# Altium schematic sheet POWER.SchDoc: HDMI POWER
size A4; SheetNumber: 5; SheetTotal: 5; DOC_NO_SCH_DWG: #012022051404
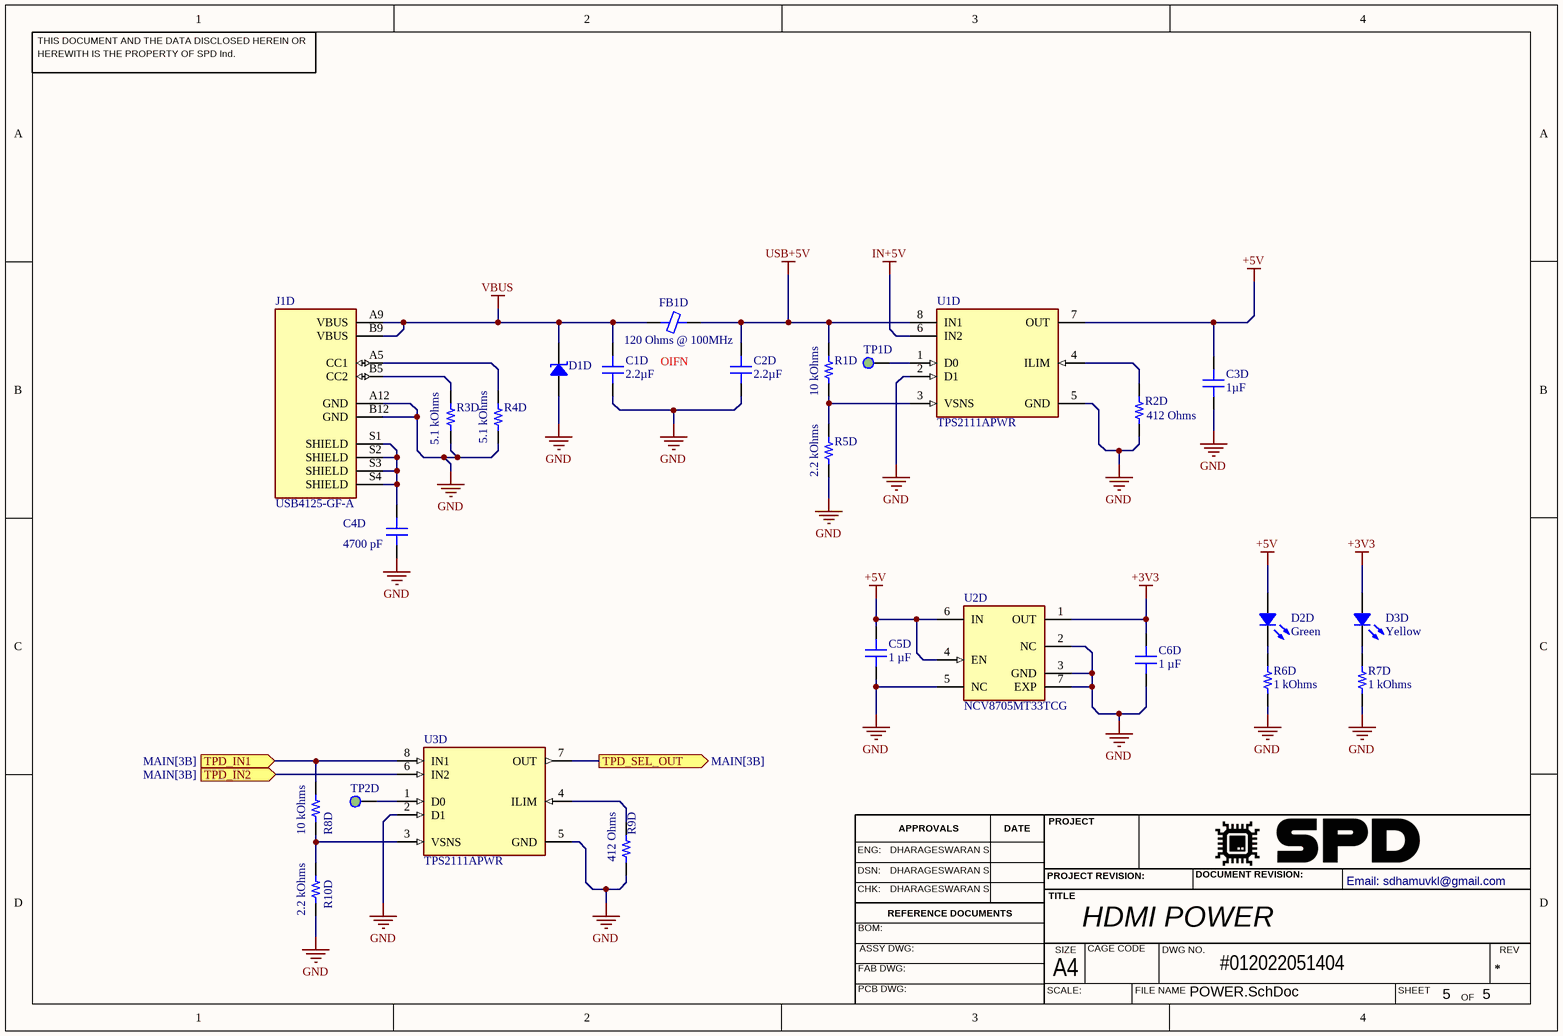
[diagram p0: POWER.SchDoc]

## Parts
C1D  2.2µF  [CAP 0402_1005]
C2D  2.2µF  [CAP 0402_1005]
C3D  1µF  [CAP 0603_1608]
C4D  4700 pF  [CAP 0402_1005]
C5D  1 µF  [CAP 0402_1005]
C6D  1 µF  [CAP 0402_1005]
D1D  VTVS5V0ASMF-M3-08  [SMF DO-219AB]  (value not drawn)
D2D  Green  [LED 0402_1005 GREEN]
D3D  Yellow  [LED 0402_1005 YELLOW]
FB1D  120 Ohms @ 100MHz  [FER 0201_0603]
J1D  USB4125-GF-A  [USB4125-GF-A]
R1D  10 kOhms  [RES 0402_1005]
R2D  412 Ohms  [RES 0402_1005]
R3D  5.1 kOhms  [RES 0402_1005]
R4D  5.1 kOhms  [RES 0402_1005]
R5D  2.2 kOhms  [RES 0402_1005]
R6D  1 kOhms  [RES 0402_1005]
R7D  1 kOhms  [RES 0402_1005]
R8D  10 kOhms  [RES 0402_1005]
R9D  412 Ohms  [RES 0402_1005]
R10D  2.2 kOhms  [RES 0402_1005]
TP1D  ROUND PAD 0.5MM  [ROUND PAD 0.5MM]  (value not drawn)
TP2D  ROUND PAD 0.5MM  [ROUND PAD 0.5MM]  (value not drawn)
U1D  TPS2111APWR  [FP-PW0008A-IPC_B]
U2D  NCV8705MT33TCG  [FP-511BR-MFG]
U3D  TPS2111APWR  [FP-PW0008A-IPC_B]

## Ports
TPD_IN1 (in, see MAIN[3B]), TPD_IN2 (in, see MAIN[3B]), TPD_SEL_OUT (out, see MAIN[3B])

## Nets
+3V3: C6D.2 D3D.1 U2D.1(OUT)
+5V: C3D.2 C5D.2 D2D.1 U1D.7(OUT) U2D.4(EN) U2D.6(IN)
GND: C1D.1 C2D.1 C3D.1 C4D.1 C5D.1 C6D.1 D1D.1 J1D.A12(GND) J1D.B12(GND) R2D.1 R3D.1 R4D.1 R5D.1 R6D.1 R7D.1 R9D.1 R10D.1 U1D.2(D1) U1D.5(GND) U2D.2(NC) U2D.3(GND) U2D.5(NC) U2D.7(EXP) U3D.2(D1) U3D.5(GND)
IN+5V: U1D.6(IN2)
USB+5V: C2D.2 FB1D.2 R1D.2 U1D.8(IN1)
VBUS: C1D.2 D1D.2 FB1D.1 J1D.A9(VBUS) J1D.B9(VBUS)
TPD_IN1: R8D.2 U3D.8(IN1) ; port TPD_IN1
TPD_IN2: U3D.6(IN2) ; port TPD_IN2
TPD_SEL_OUT: U3D.7(OUT) ; port TPD_SEL_OUT
NetC4D_2: C4D.2 J1D.S1(SHIELD) J1D.S2(SHIELD) J1D.S3(SHIELD) J1D.S4(SHIELD)
NetD2D_2: D2D.2 R6D.2
NetD3D_2: D3D.2 R7D.2
NetJ1D_A5: J1D.A5(CC1) R4D.2
NetJ1D_B5: J1D.B5(CC2) R3D.2
NetR1D_1: R1D.1 R5D.2 U1D.3(VSNS)
NetR2D_2: R2D.2 U1D.4(ILIM)
NetR8D_1: R8D.1 R10D.2 U3D.3(VSNS)
NetR9D_2: R9D.2 U3D.4(ILIM)
NetTP1D_1: TP1D.1 U1D.1(D0)
NetTP2D_1: TP2D.1 U3D.1(D0)

## Notes on the sheet
- OIFN
- THIS DOCUMENT AND THE DATA DISCLOSED HEREIN OR
- HEREWITH IS THE PROPERTY OF SPD Ind.
- ENG:
- DHARAGESWARAN S
- APPROVALS
- DATE
- PROJECT
- DSN:
- CHK:
- REFERENCE DOCUMENTS
- PROJECT REVISION:
- TITLE
- DOCUMENT REVISION:
- Email: sdhamuvkl@gmail.com <https://github.com/DhamuVkl>
- BOM:
- FAB DWG:
- PCB DWG:
- ASSY DWG:
- SCALE:
- A4
- SIZE
- CAGE CODE
- FILE NAME
- DWG NO.
- SHEET
- REV
- OF

## Library data of the parts
C1D C2D = 0402ZD225KAT2A: CAP CER 2.2UF 10V X5R 0402; Manufacturer: AVX Corporation; id: 2335; Tolerance: ±10%; Part Number: 0402ZD225KAT2A; Value: 2.2µF; Temperature Coefficient: X5R; Supplier Part Number 1: 478-10072-1-ND; ComponentLink2Description: DigiKey Link; ComponentLink1URL: http://datasheets.avx.com/cx5r.pdf; PartId: 9346; Supplier 1: DigiKey; Series: -; LastUpdated: 2022-02-08T12:26:45.707; Part Status: Active; Capacitance: 2.2µF; Device Package: 0402 (1005 Metric); Thickness (Max): 0.022" (0.56mm); Voltage - Rated: 10V; Minimum Order: 1; Packaging: TapeAndReel; Applications: General Purpose; Package / Case: 0402 (1005 Metric); ComponentLink1Description: Datasheet; Price: 0.09; ComponentLink2URL: http://digikey.com/product-detail/en/avx-corporation/0402ZD225KAT2A/478-10072-1-ND/6564294; Lifecycle Status: Active; Operating Temperature: -55°C ~ 85°C; Size / Dimension: 0.039" L x 0.020" W (1.00mm x 0.50mm); Mounting Type: Surface Mount, MLCC
C3D = 06036D105KAT2A: CAP CER 1UF 6.3V X5R 0603; Manufacturer: AVX Corporation; id: 2190; Tolerance: ±10%; Part Number: 06036D105KAT2A; Value: 1µF; Temperature Coefficient: X5R; Supplier Part Number 1: 478-2581-1-ND; ComponentLink2Description: DigiKey Link; ComponentLink1URL: http://datasheets.avx.com/cx5r.pdf; PartId: 11585; Supplier 1: DigiKey; Series: -; LastUpdated: 2020-09-02T01:03:18.933; Part Status: Active; Capacitance: 1µF; Device Package: 0603 (1608 Metric); Thickness (Max): 0.035" (0.90mm); Voltage - Rated: 6.3V; Minimum Order: 1; Packaging: TapeAndReel; Applications: General Purpose; Package / Case: 0603 (1608 Metric); ComponentLink1Description: Datasheet; Price: 0.03; ComponentLink2URL: http://digikey.com/product-detail/en/avx-corporation/06036D105KAT2A/478-2581-1-ND/717526; Lifecycle Status: Active; Operating Temperature: -55°C ~ 85°C; Size / Dimension: 0.063" L x 0.032" W (1.60mm x 0.81mm); Mounting Type: Surface Mount, MLCC
C4D = C0402C472K4RECAUTO: CAP CER 0402 4.7NF 16V X7R 10%; Manufacturer: KEMET; id: 3032; Part Number: C0402C472K4RECAUTO; Value: 4700 pF; Temperature Coefficient: X7R; Supplier Part Number 1: 399-17875-1-ND; ComponentLink2Description: DigiKey Link; ComponentLink1URL: https://api.kemet.com/component-edge/download/datasheet/C0402C472K4RECAUTO.pdf; PartId: 12122; Tolerance: ±10%; Supplier 1: DigiKey; Series: ESD SMD Auto X7R; LastUpdated: 2023-01-03T20:03:46.940; Part Status: Active; Capacitance: 4700 pF; Device Package: 0402 (1005 Metric); Ratings: AEC-Q200; Thickness (Max): 0.022" (0.55mm); Voltage - Rated: 16V; Minimum Order: 1; Packaging: TapeAndReel; Applications: Automotive, ESD Protection; Package / Case: 0402 (1005 Metric); ComponentLink1Description: Datasheet; Price: 0.01; ComponentLink2URL: https://www.digikey.com/en/products/detail/kemet/C0402C472K4RECAUTO/8640469; Lifecycle Status: Active; Operating Temperature: -55°C ~ 125°C; Size / Dimension: 0.039" L x 0.020" W (1.00mm x 0.50mm); Mounting Type: Surface Mount, MLCC
C5D C6D = GRM155C81C105KE11D: CAP CER 1UF 16V X6S 0402; Manufacturer: Murata Electronics; id: 824; Tolerance: ±10%; Part Number: GRM155C81C105KE11D; Value: 1 µF; Temperature Coefficient: X6S; Supplier Part Number 1: 490-12700-1-ND; ComponentLink2Description: DigiKey Link; ComponentLink1URL: https://search.murata.co.jp/Ceramy/image/img/A01X/G101/ENG/GRM155C81C105KE11-01.pdf; PartId: 3683; Supplier 1: DigiKey; Series: GRM; LastUpdated: 2023-01-03T20:04:13.167; Part Status: Active; Capacitance: 1 µF; Device Package: 0402 (1005 Metric); Thickness (Max): 0.024" (0.60mm); Voltage - Rated: 16V; Minimum Order: 1; Packaging: TapeAndReel; Applications: General Purpose; Package / Case: 0402 (1005 Metric); ComponentLink1Description: Datasheet; Price: 0.01; ComponentLink2URL: https://www.digikey.com/en/products/detail/murata-electronics/GRM155C81C105KE11D/4905091; Lifecycle Status: Active; Operating Temperature: -55°C ~ 105°C; Size / Dimension: 0.039" L x 0.020" W (1.00mm x 0.50mm); Mounting Type: Surface Mount, MLCC
D1D = VTVS5V0ASMF-M3-08: TVS DIODE 5V 8.9V DO219AB; Manufacturer: Vishay Semiconductor Diodes Division; id: 18; Voltage - Breakdown (Min): 6.4V; Power Line Protection: No; Capacitance @ Frequency: 2095pF @ 1MHz; Type: Zener; Current - Peak Pulse (10/1000µs): 42.95A; Power - Peak Pulse: 400W; Unidirectional Channels: 1; Part Number: VTVS5V0ASMF-M3-08; Supplier Part Number 1: VTVS5V0ASMF-M3-08GICT-ND; Voltage - Reverse Standoff (Typ): 5V; Voltage - Clamping (Max) @ Ipp: 8.9V; Supplier Device Package: DO-219AB (SMF); ComponentLink1Description: Datasheet; ComponentLink2URL: http://digikey.com/product-detail/en/vishay-semiconductor-diodes-division/VTVS5V0ASMF-M3-08/VTVS5V0ASMF-M3-08GICT-ND/7056003; ComponentLink1URL: http://www.vishay.com/docs/85891/vtvs3v3asmf.pdf; Supplier 1: DigiKey; Series: TransZorb®; Part Status: Active; ComponentLink2Description: DigiKey Link; Packaging: TapeAndReel; Minimum Order: 1; Applications: General Purpose; Package / Case: DO-219AB; PartId: 5492; Lifecycle Status: Active; LastUpdated: 2023-01-02T21:08:29.887; Operating Temperature: -55°C ~ 175°C (TJ); Mounting Type: Surface Mount; Price: 0.11
D2D = HSMG-C280: LED GREEN DIFFUSED 0402 SMD; Manufacturer: Broadcom Limited; id: 697; Lens Color: White; Wavelength - Peak: 570nm; Lens Style: Rectangle with Flat Top; Viewing Angle: 130°; Lens Size: 1.00mm x 0.50mm; Configuration: Standard; Wavelength - Dominant: 572nm; Voltage - Forward (Vf) (Typ): 2.2V; Current - Test: 20mA; Millicandela Rating: 15mcd; Part Number: HSMG-C280; Supplier Part Number 1: 516-3066-1-ND; Lens Transparency: Diffused; Supplier Device Package: 0402; ComponentLink1Description: Datasheet; Color: Green; ComponentLink2URL: https://www.digikey.com/en/products/detail/broadcom-limited/HSMG-C280/1235358; ComponentLink1URL: https://docs.broadcom.com/docs/AV02-0602EN; Supplier 1: DigiKey; Series: -; Height (Max): 0.40mm; Part Status: Active; ComponentLink2Description: DigiKey Link; Device Package: 0402 (1005 Metric); Packaging: TapeAndReel; Minimum Order: 1; Package / Case: 0402 (1005 Metric); PartId: 697; Lifecycle Status: Active; LastUpdated: 2023-01-02T20:56:26.750; Value: Green; Size / Dimension: 1.00mm L x 0.50mm W; Mounting Type: Surface Mount; Price: 0.08
D3D = XZMYK68W-2: LED YELLOW CLEAR CHIP SMD; Manufacturer: SunLED; id: 167; Lens Color: Colorless; Wavelength - Peak: 590nm; Lens Style: Rectangle with Flat Top; Viewing Angle: 120°; Lens Size: 0.80mm x 0.50mm; Configuration: Standard; Voltage - Forward (Vf) (Typ): 2V; Current - Test: 20mA; Millicandela Rating: 148mcd; Part Number: XZMYK68W-2; Supplier Part Number 1: 1497-1198-1-ND; Lens Transparency: Clear; Supplier Device Package: Chip LED; ComponentLink1Description: Datasheet; Color: Yellow; ComponentLink2URL: https://www.digikey.com/en/products/detail/sunled/XZMYK68W-2/4745801; ComponentLink1URL: https://www.sunledusa.com/products/spec/XZMYK68W-2.pdf; Supplier 1: DigiKey; Series: -; Height (Max): 0.60mm; Part Status: Active; ComponentLink2Description: DigiKey Link; Device Package: 0402 (1005 Metric); Packaging: TapeAndReel; Minimum Order: 1; Package / Case: 0402 (1005 Metric); PartId: 167; Wavelength - Dominant: 590nm; Lifecycle Status: Active; LastUpdated: 2023-01-02T20:57:30.307; Value: Yellow; Size / Dimension: 1.00mm L x 0.50mm W; Mounting Type: Surface Mount; Price: 0.05
FB1D = BKP0603HM121-T: FERRITE BEAD 120 OHM 0201 1LN; Manufacturer: Taiyo Yuden; id: 127; DC Resistance (DCR) (Max): 180mOhm; Number Of Lines: 1; Filter Type: Power Line; Current Rating (Max): 800mA; Part Number: BKP0603HM121-T; Supplier Part Number 1: 587-3283-1-ND; ComponentLink1Description: Datasheet; ComponentLink2URL: http://digikey.com/product-detail/en/taiyo-yuden/BKP0603HM121-T/587-3283-1-ND/4157927; ComponentLink1URL: https://ds.yuden.co.jp/TYCOMPAS/ut/detail?pn=BKP0603HM121-T  &u=M; Supplier 1: DigiKey; Series: BK; Height (Max): 0.013" (0.33mm); Part Status: Active; ComponentLink2Description: DigiKey Link; Device Package: 0201 (0603 Metric); Impedance @ Frequency: 120 Ohms @ 100MHz; Packaging: TapeAndReel; Minimum Order: 1; Package / Case: 0201 (0603 Metric); PartId: 127; Lifecycle Status: Active; LastUpdated: 2023-01-02T20:50:51.660; Operating Temperature: -55°C ~ 85°C; Value: 120 Ohms @ 100MHz; Size / Dimension: 0.024" L x 0.012" W (0.60mm x 0.30mm); Mounting Type: Surface Mount; Price: 0.03
J1D = USB4125-GF-A: CONN RCPT TYPE C 6P SMD RA; Manufacturer: GCT; MP: USB4125-GF-A_REVA2; id: 21; Mating Cycles: 20000; Current Rating (Amps): 3A; Connector Type: USB-C (USB TYPE-C); Number Of Contacts: 24 (6+18 Dummy); Voltage - Rated: 20VDC; Shielding: Shielded; Number Of Ports: 1; Gender: Receptacle; Package: None; Availability: Unavailable; Value: *; Price: 0.67; Part Number: USB4125-GF-A; Supplier Part Number 1: 2073-USB4125-GF-ACT-ND; Specifications: -; Termination: Solder; ComponentLink1Description: Datasheets; ComponentLink6URL: https://gct.co/files/info/gct_certificate_of_compliance.pdf; ComponentLink2URL: https://mm.digikey.com/Volume0/opasdata/d220001/medias/docus/5561/USB4125 - Product Spec.pdf; Features: Power Only, No Data; Solder Retention Tab; ComponentLink1URL: https://mm.digikey.com/Volume0/opasdata/d220001/medias/docus/5407/gct-usb-type-c-product-selection-guide-2023-v1.5_web.pdf; Mounting Feature: Horizontal; Supplier 1: DigiKey; Series: USB4125; ComponentLink6Description: Environmental Information; Part Status: Active; ComponentLink5URL: https://www.digikey.com/api/videos/videoplayer/smallplayer/6247993315001; Ingress Protection: -; ComponentLink2Description: Datasheets; Device Package: Cut Tape (CT); Packaging: Cut Tape (CT); ComponentLink5Description: Video File; Minimum Order: 1; Lifecycle Status: Active; LastUpdated: 2023-10-13T19:13:52.5975723; ComponentLink4URL: https://mm.digikey.com/Volume0/opasdata/d220001/medias/images/2644/MFG_USB4125-GF-A.jpg; Operating Temperature: -30°C ~ 85°C; ComponentLink4Description: Product Photos; Mounting Type: Surface Mount, Right Angle; Through Hole; ComponentLink3Description: Datasheets; ComponentLink3URL: https://mm.digikey.com/Volume0/opasdata/d220001/medias/docus/5561/USB4125 - Product Drawing.pdf
R1D R8D = AA0402FR-0710KL: RES SMD 10K OHM 1% 1/16W 0402; Manufacturer: Yageo; id: 10610; Temperature Coefficient: ±150ppm/°C; Power (Watts): 0.063W, 1/16W; Part Number: AA0402FR-0710KL; Height - Seated (Max): 0.015" (0.37mm); Supplier Part Number 1: 13-AA0402FR-0710KLCT-ND; Supplier Device Package: 0402; ComponentLink1Description: Datasheet; ComponentLink2URL: https://www.digikey.com/en/products/detail/yageo/AA0402FR-0710KL/5887729; Features: Anti-Sulfur, Automotive AEC-Q200, Moisture Resistant; ComponentLink1URL: https://www.yageo.com/upload/media/product/productsearch/datasheet/rchip/PYu-AA_51_RoHS_L_3.pdf; Composition: Thick Film; Tolerance: ±1%; Supplier 1: DigiKey; Series: AA; Part Status: Active; ComponentLink2Description: DigiKey Link; Device Package: 0402 (1005 Metric); Packaging: TapeAndReel; Ratings: AEC-Q200; Minimum Order: 1; Package / Case: 0402 (1005 Metric); PartId: 59190; Lifecycle Status: Active; LastUpdated: 2023-01-02T20:20:10.303; Operating Temperature: -55°C ~ 155°C; Number Of Terminations: 2; Value: 10 kOhms; Size / Dimension: 0.039" L x 0.020" W (1.00mm x 0.50mm); Price: 0.01; Resistance: 10 kOhms
R2D R9D = CR0402-FX-4120GLF: RES SMD 412 OHM 1% 1/16W 0402; Manufacturer: Bourns Inc.; id: 6537; Temperature Coefficient: ±100ppm/°C; Power (Watts): 0.063W, 1/16W; Part Number: CR0402-FX-4120GLF; Height - Seated (Max): 0.016" (0.40mm); Supplier Part Number 1: CR0402-FX-4120GLFCT-ND; Supplier Device Package: 0402; ComponentLink1Description: Datasheet; ComponentLink2URL: https://www.digikey.com/en/products/detail/bourns-inc/CR0402-FX-4120GLF/3783365; ComponentLink1URL: https://www.bourns.com/docs/Product-Datasheets/CR0402.pdf; Composition: Thick Film; Tolerance: ±1%; Supplier 1: DigiKey; Series: CR0402; Part Status: Active; ComponentLink2Description: DigiKey Link; Device Package: 0402 (1005 Metric); Packaging: CutTape; Minimum Order: 1; Package / Case: 0402 (1005 Metric); PartId: 15070; Lifecycle Status: Active; LastUpdated: 2023-01-02T20:20:56.940; Operating Temperature: -55°C ~ 155°C; Number Of Terminations: 2; Value: 412 Ohms; Size / Dimension: 0.039" L x 0.020" W (1.00mm x 0.50mm); Price: 0.01; Resistance: 412 Ohms
R3D R4D = AC0402FR-075K1L: RES SMD 5.1K OHM 1% 1/16W 0402; Manufacturer: Yageo; id: 5028; Temperature Coefficient: ±100ppm/°C; Power (Watts): 0.063W, 1/16W; Part Number: AC0402FR-075K1L; Height - Seated (Max): 0.015" (0.37mm); Supplier Part Number 1: YAG3503CT-ND; Supplier Device Package: 0402; ComponentLink1Description: Datasheet; ComponentLink2URL: https://www.digikey.com/en/products/detail/yageo/AC0402FR-075K1L/5895438; Features: Automotive AEC-Q200, Moisture Resistant; ComponentLink1URL: https://www.yageo.com/upload/media/product/productsearch/datasheet/rchip/PYu-AC_51_RoHS_L_7.pdf; Composition: Thick Film; Tolerance: ±1%; Supplier 1: DigiKey; Series: AC; Part Status: Active; ComponentLink2Description: DigiKey Link; Device Package: 0402 (1005 Metric); Packaging: CutTape; Ratings: AEC-Q200; Minimum Order: 1; Package / Case: 0402 (1005 Metric); PartId: 12111; Lifecycle Status: Active; LastUpdated: 2023-01-02T20:21:09.567; Operating Temperature: -55°C ~ 155°C; Number Of Terminations: 2; Value: 5.1 kOhms; Size / Dimension: 0.039" L x 0.020" W (1.00mm x 0.50mm); Price: 0.01; Resistance: 5.1 kOhms
R5D R10D = AC0402JR-072K2L: RES SMD 2.2K OHM 5% 1/16W 0402; Manufacturer: Yageo; id: 7769; Temperature Coefficient: ±100ppm/°C; Power (Watts): 0.063W, 1/16W; Part Number: AC0402JR-072K2L; Height - Seated (Max): 0.015" (0.37mm); Supplier Part Number 1: YAG3536CT-ND; Supplier Device Package: 0402; ComponentLink1Description: Datasheet; ComponentLink2URL: https://www.digikey.com/en/products/detail/yageo/AC0402JR-072K2L/5895634; Features: Automotive AEC-Q200, Moisture Resistant; ComponentLink1URL: https://www.yageo.com/upload/media/product/productsearch/datasheet/rchip/PYu-AC_51_RoHS_L_7.pdf; Composition: Thick Film; Tolerance: ±5%; Supplier 1: DigiKey; Series: AC; Part Status: Active; ComponentLink2Description: DigiKey Link; Device Package: 0402 (1005 Metric); Packaging: CutTape; Ratings: AEC-Q200; Minimum Order: 1; Package / Case: 0402 (1005 Metric); PartId: 17508; Lifecycle Status: Active; LastUpdated: 2023-01-02T20:20:46.197; Operating Temperature: -55°C ~ 155°C; Number Of Terminations: 2; Value: 2.2 kOhms; Size / Dimension: 0.039" L x 0.020" W (1.00mm x 0.50mm); Price: 0.01; Resistance: 2.2 kOhms
R6D R7D = AA0402FR-071KL: RES SMD 1K OHM 1% 1/16W 0402; Manufacturer: Yageo; id: 10598; Temperature Coefficient: ±150ppm/°C; Power (Watts): 0.063W, 1/16W; Part Number: AA0402FR-071KL; Height - Seated (Max): 0.015" (0.37mm); Supplier Part Number 1: 13-AA0402FR-071KLCT-ND; Supplier Device Package: 0402; ComponentLink1Description: Datasheet; ComponentLink2URL: https://www.digikey.com/en/products/detail/yageo/AA0402FR-071KL/5887878; Features: Anti-Sulfur, Automotive AEC-Q200, Moisture Resistant; ComponentLink1URL: https://www.yageo.com/upload/media/product/productsearch/datasheet/rchip/PYu-AA_51_RoHS_L_3.pdf; Composition: Thick Film; Tolerance: ±1%; Supplier 1: DigiKey; Series: AA; Part Status: Active; ComponentLink2Description: DigiKey Link; Device Package: 0402 (1005 Metric); Packaging: TapeAndReel; Ratings: AEC-Q200; Minimum Order: 1; Package / Case: 0402 (1005 Metric); PartId: 59178; Lifecycle Status: Active; LastUpdated: 2023-01-02T20:20:10.210; Operating Temperature: -55°C ~ 155°C; Number Of Terminations: 2; Value: 1 kOhms; Size / Dimension: 0.039" L x 0.020" W (1.00mm x 0.50mm); Price: 0.01; Resistance: 1 kOhms
U1D U3D = CMP-0339-00036-3: IC OR CTRLR SRC SELECT 8TSSOP; Turn-Off Delay Time: 5ms; Number of Outputs: 1; Turn-On Delay Time: 1ms; Operating Supply Current: 55uA; On-State Resistance: 84mR; Current - Output 2: 1.25A; Operating Supply Voltage: 5.5V; Max Power Dissipation: 387mW; Min Input Voltage: 2.8V; Number of Circuits: 2; Output Voltage: 6V; Number of Pins: 8; REACH SVHC: No SVHC; Package Quantity: 1; Max Operating Temperature: 85°C; Nominal Supply Current: 55uA; Packaging: Tape and Reel; Min Operating Temperature: -40°C; Output Current: 1.25A; Lead Free: Lead Free; Max Output Current: 1.25A; Max Input Voltage: 5.5V; Case/Package: TSSOP; Radiation Hardening: No; Number of Inputs: 2; Weight: 0.001376oz
U2D = CMP-07128-000006-2: IC REG LINEAR 3.3V 500MA 6WDFN; Number of Outputs: 1; Min Input Voltage: 2.5V; Accuracy: 2%; Min Current Limit: 510mA; Polarity: Positive; Output Type: Fixed; Quiescent Current: 25uA; Dropout Voltage: 230mV; Max Input Voltage: 5.5V; Number of Pins: 6; Mount: Surface Mount; Package Quantity: 3000; Lead Free: Lead Free; Radiation Hardening: No; Min Operating Temperature: -40°C; Number of Regulators: 1; Max Operating Temperature: 125°C; Output Current: 500mA; Max Output Current: 500mA; Packaging: Tape and Reel; Output Voltage: 3.3V